# EAGLE design esp8266-relay (EAGLE 7.2.0)
CNAME: ESP8266 Relay; CREVISION: 0.1; DESIGNER: dru / RNDC
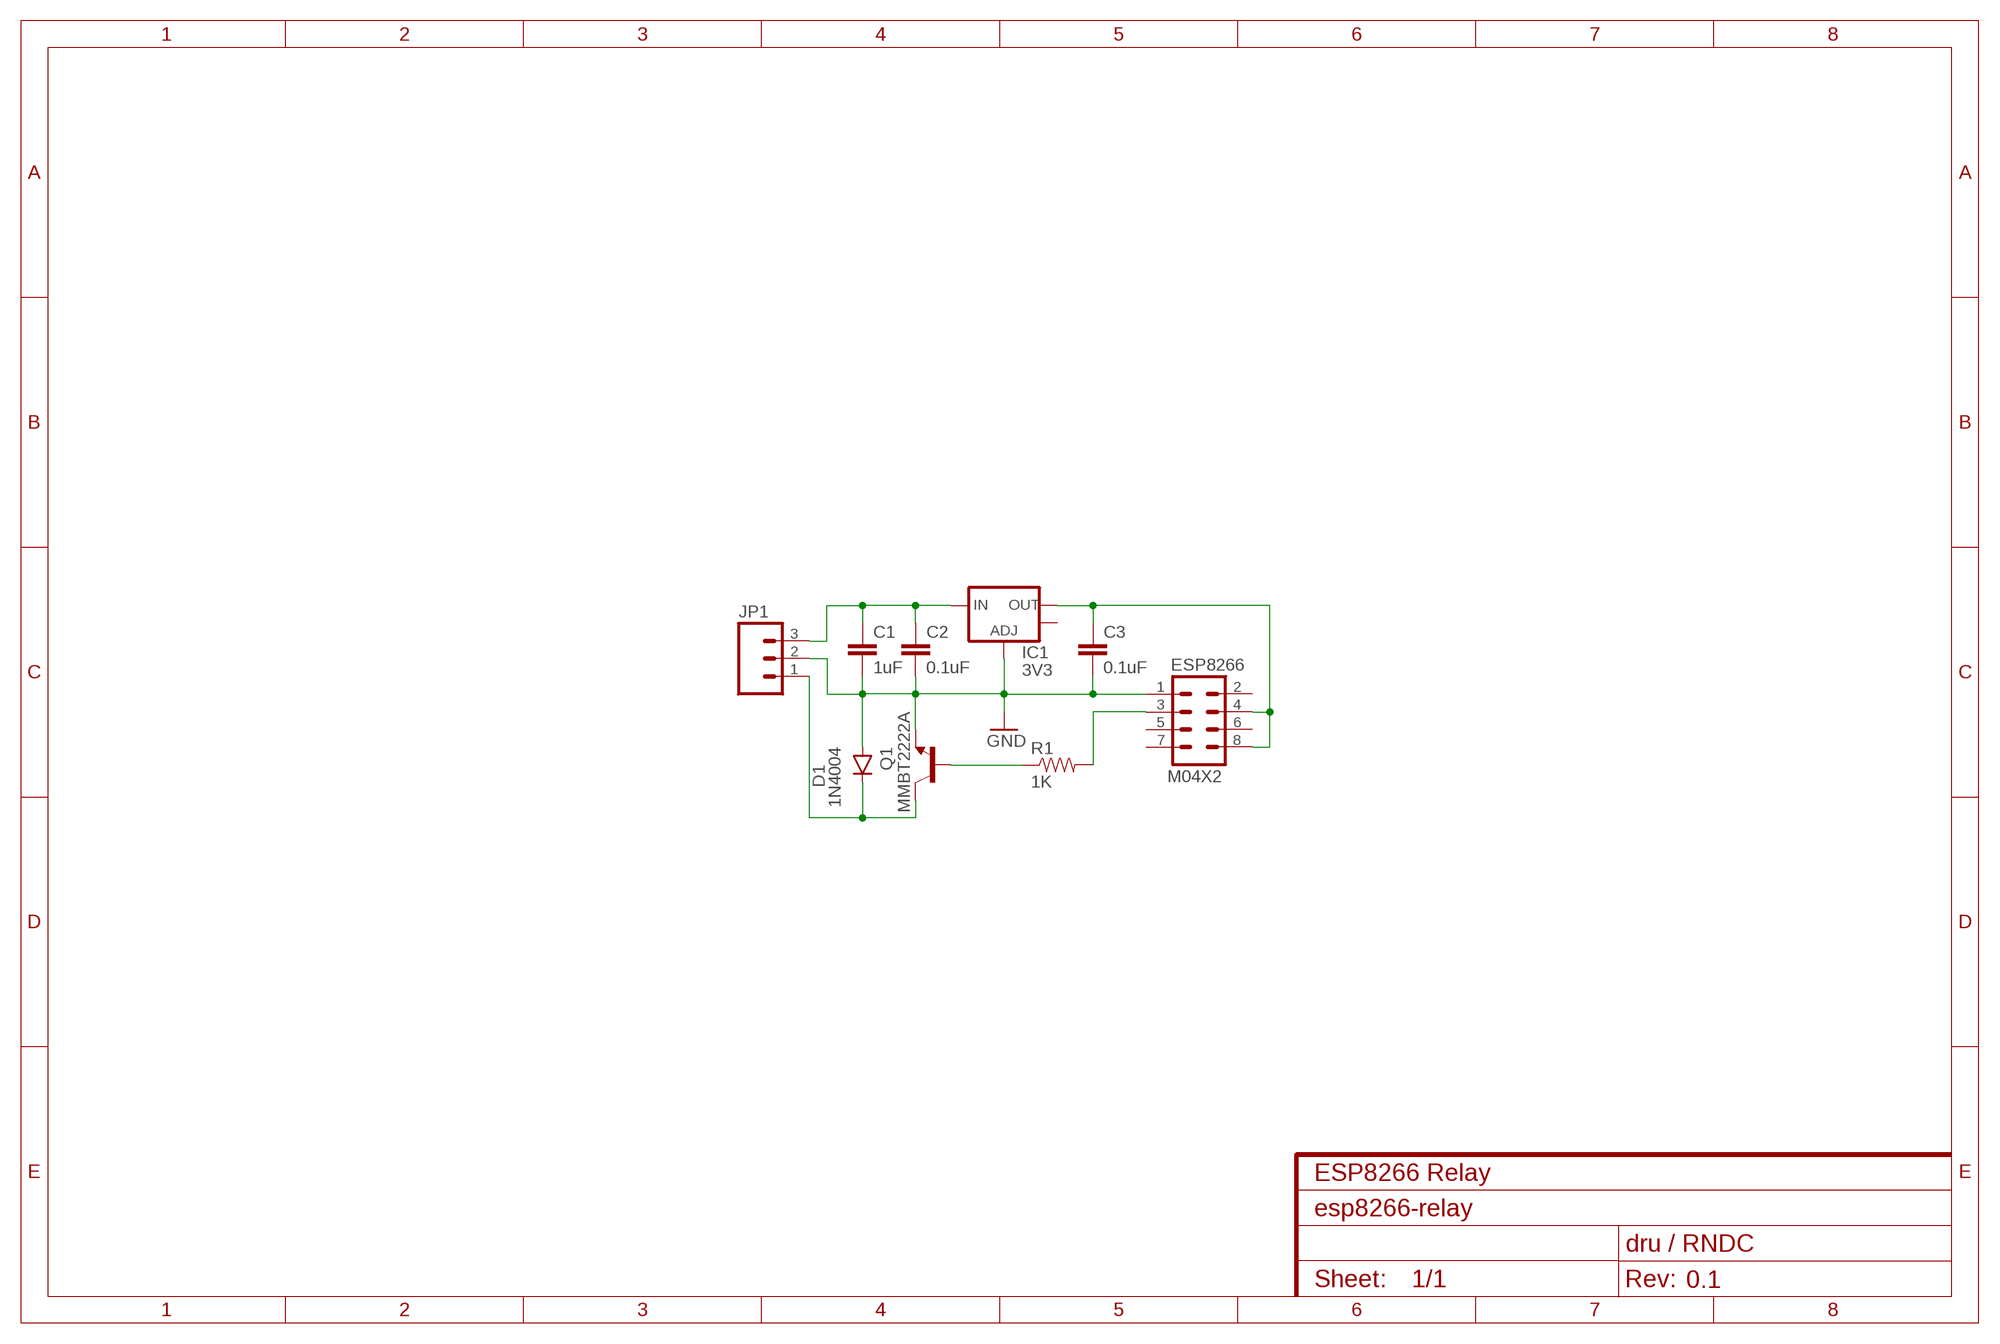
[diagram p0: schematic, sheet 1]

## Parts
C1  1uF  CAP0603-CAP  [0603-CAP]
C2  0.1uF  CAP0805  [0805]
C3  0.1uF  CAP0805  [0805]
D1  1N4004  DIODESMA-ALT  [SMA-DIODE_ALT]
ESP8266  M04X2  [2X4]
IC1  3V3  V_REG_LM1117SOT223  [SOT223]
JP1  M03PTH  [1X03]
Q1  MMBT2222A  TRANSISTOR_NPNMMBT2222A  [SOT23-3]
R1  1K  RESISTOR0603-RES  [0603-RES]

## Nets
GND: C1.2 C2.2 C3.2 D1.A ESP8266.1 IC1.1(ADJ) JP1.2 Q1.2(E)
N$1: C1.1 C2.1 IC1.3(IN) JP1.3
N$2: C3.1 ESP8266.4 ESP8266.8 IC1.2(OUT)
N$3: D1.C JP1.1 Q1.3(C)
N$4: Q1.1(B) R1.1
N$5: ESP8266.3 R1.2
Unconnected: ESP8266.2 ESP8266.5 ESP8266.6 ESP8266.7 IC1.4(OUT)

## Library data of the parts
C1-C3 = SparkFun-Passives:CAP: Capacitor Standard 0603 ceramic capacitor, and 0.1" leaded capacitor.
D1 = SparkFun-DiscreteSemi:DIODE: Diode These are standard reverse protection diodes and small signal diodes. SMA package can handle up to about 1A. SOD-323 can handle about 200mA. What the SOD-323 package when ordering, there are some mfgs out there that are 5-pin packages.
ESP8266 = SparkFun-Connectors:M04X2: .1" header, two rows of four.
IC1 = SparkFun-PowerIC:V_REG_LM1117: Voltage Regulator LM1117 Standard adjustable voltage regulator but in SMD form. Spark Fun Electronics SKU : COM-00595
JP1 = SparkFun-Connectors:M03: Header 3 Standard 3-pin 0.1" header. Use with straight break away headers (SKU : PRT-00116), right angle break away headers (PRT-00553), swiss pins (PRT-00743), machine pins (PRT-00117), and female headers (PRT-00115). Molex polarized connector foot print use with SKU : PRT-08232 with associated crimp pins and housings.
Q1 = SparkFun-DiscreteSemi:TRANSISTOR_NPN: Generic NPN BJT MMBT2222A - TRANS-08049 (SOT-23, 1A 40V) MPSA42 - TRANS-09116 (SOT-23, 500mA 300V) MMBT5088LT1G - TRANS-11160 (SOT-23, 50 mA 30V) BC547 - COM-08928 <http://www.sparkfun.com/products/8928> (TO-92 45V 100mA) (1.Collector 2.Base 3.Emitter) 2N3904 - COM-00521 <http://www.sparkfun.com/products/521> (TO-92 40V 200mA) (1.Emitter 2.Base 3.Collector) P2N2222A - COM-12852 <http://www.sparkfun.com/products/12852> (TO-92 40V 600mA) (1.Collector 2.Base 3.Emitter); PROD_ID: TRANS-08049
R1 = SparkFun-Passives:RESISTOR: Resistor Basic schematic elements and footprints for 0603, 1206, and PTH resistors.

## Board
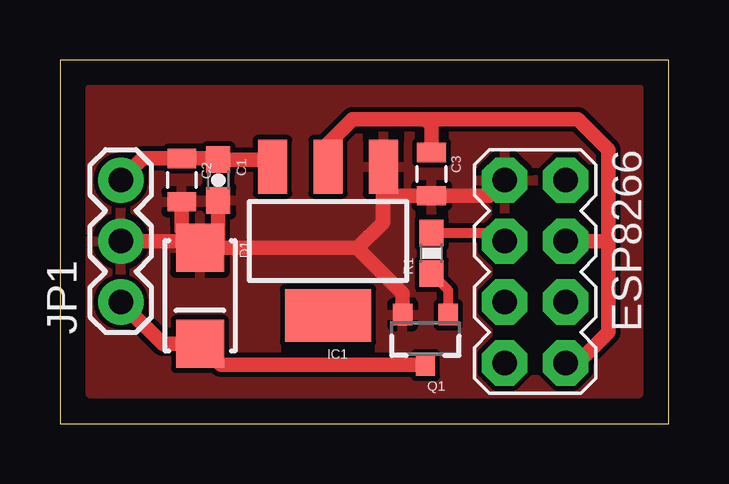
[diagram p1: board, top side]

Size 25.38 x 15.16 mm. Coordinates in mm from the lower left corner, seen from the top.
Outline: 0,0 25.38,0 25.38,15.16 0,15.16 0,0
Copper layers (1*16): Top 0.035mm / dielectric 1.5mm / Bottom 0.035mm
Design rules "default": minimum track width 10mil, minimum drill 24mil, track to track 8mil, track to pad 8mil, pad to pad 8mil, via to via 8mil, smd to smd 8mil, copper to edge 40mil, drill to drill 8mil, minimum pad ring 10mil, minimum via ring 8mil, stop-mask expansion 4mil, vias tented up to drill 0mil, thermal gap 10mil

### Footprints (pad centres in the part's own frame; a part is rotated, then mirrored left to right if it is on the bottom)
0603-CAP = smd 1.1 x 1: 1 -0.85,0; 2 0.85,0
0805 = smd 0.8 x 1.2: 1 -0.9,0; 2 0.9,0
SMA-DIODE_ALT = smd 2 x 2: A -2,0; C 2,0
2X4 = drill 1.016 pad 1.88 octagon: 1 -3.81,-1.27; 2 -3.81,1.27; 3 -1.27,-1.27; 4 -1.27,1.27; 5 1.27,-1.27; 6 1.27,1.27; 7 3.81,-1.27; 8 3.81,1.27
SOT223 = smd 1.219 x 2.235: 1 -2.311,-3.099; 2 0,-3.099; 3 2.311,-3.099 | smd 3.6 x 2.2: 4 0,3.099
1X03 = drill 1.016 pad 1.88: 1 0,0; 2 2.54,0; 3 5.08,0
SOT23-3 = smd 0.8 x 0.9: 1 -0.95,-1; 2 0.95,-1; 3 0,1.1
0603-RES = smd 1.1 x 1: 1 -0.85,0; 2 0.85,0

### Placement (x,y rotation side)
C1  6.6,10.16 270 top
C2  5.08,10.16 270 top
C3  15.49,10.41 270 top
D1  5.84,5.33 270 top
ESP8266  19.81,6.35 270 top
IC1  11.18,7.62 180 top
JP1  2.54,5.08 90 top
Q1  15.24,3.56 180 top
R1  15.49,7.11 90 top

### Tracks (layer width: path | path; a pad name or v marks a point on that pad's centre or on a via)
GND
  Top 0.61: 6.35,7.33 D1.A 5.32,7.86 | 6.35,7.33 12.41,7.33 | 12.41,7.33 13.46,8.38 13.46,9.65 | 13.46,9.65 13.46,10.69 IC1.1 | C1.2 6.6,7.59 6.35,7.33 | C2.2 5.08,8.1 5.32,7.86 | JP1.2 5.08,7.62 5.32,7.86 | 13.46,9.65 13.6,9.51 C3.2 17.9,9.51 ESP8266.1 | 12.41,7.33 12.41,7.32 14.29,5.44 Q1.2
  pour Top: 1.27,13.97 1.27,1.27 24.13,1.27 24.13,13.97
N$1
  Top 0.406: 8.83,11.01 IC1.3
  Top 0.61: JP1.3 3.44,11.06 C2.1 6.55,11.06 C1.1 8.57,11.01 IC1.3
N$2
  Top 0.61: IC1.2 11.18,11.68 12.19,12.7 15.24,12.7 | 15.24,12.7 21.59,12.7 22.86,11.43 22.86,7.62 | 22.86,7.62 22.86,3.81 21.59,2.54 ESP8266.8 | ESP8266.4 22.86,7.62 | C3.1 15.49,12.45 15.24,12.7
N$3
  Top 0.61: JP1.1 4.29,3.33 D1.C 6.72,2.46 Q1.3
N$4
  Top 0.406: Q1.1 16.19,5.57 R1.1
N$5
  Top 0.406: R1.2 18.2,7.96 ESP8266.3